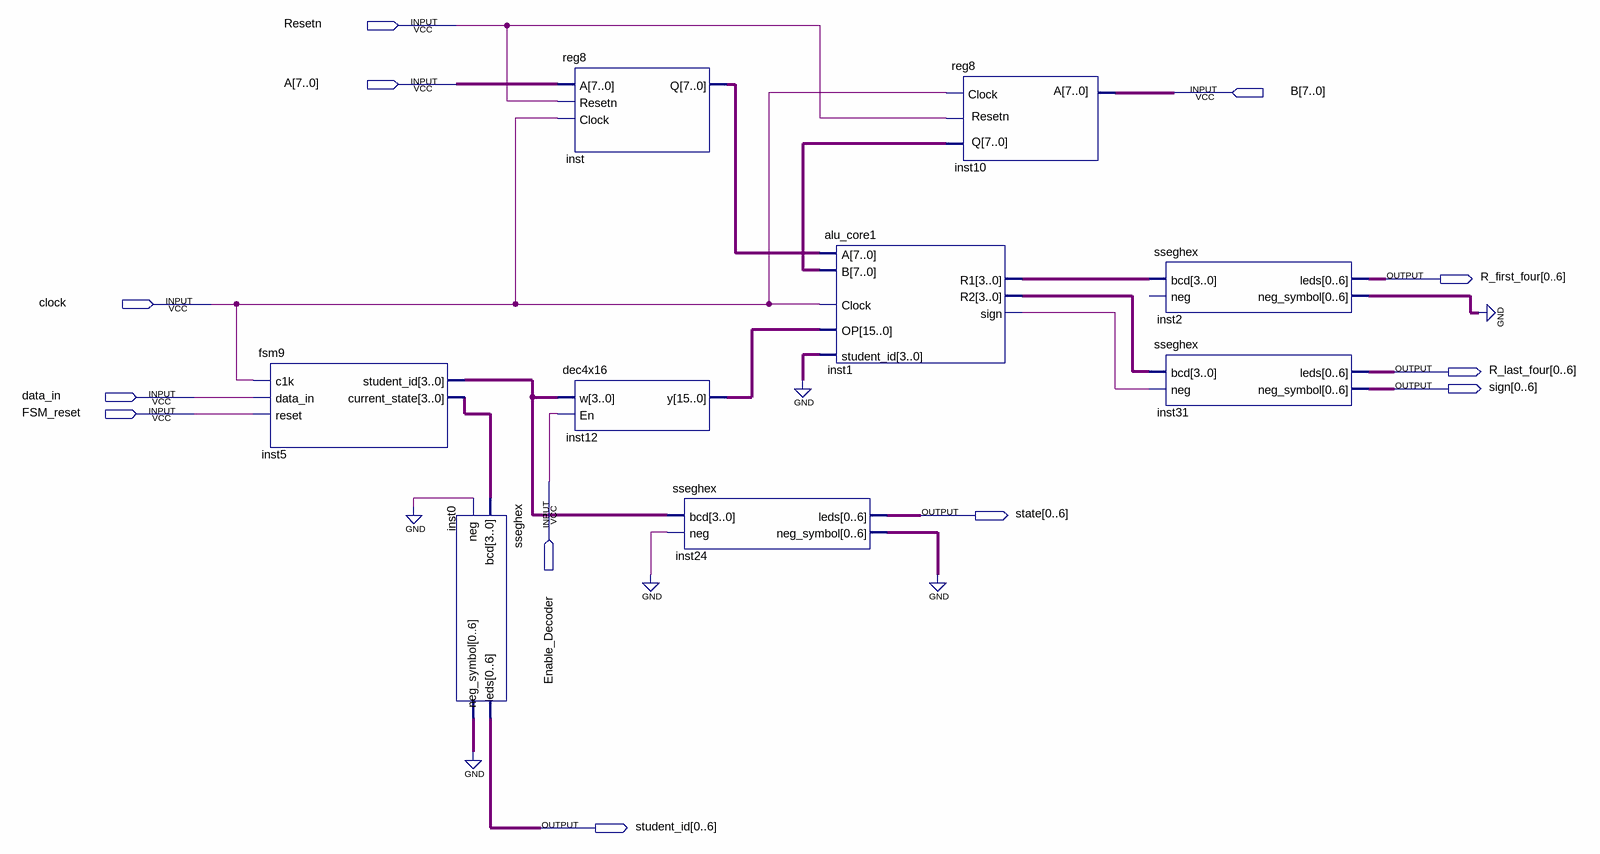
[diagram p0: schematic sheet]
// Quartus schematic Lab6_problem1.bdf as structural Verilog: 9 symbols, 12 pins
module Lab6_problem1 (
  input  Resetn,
  input  [7:0] A,
  input  [7:0] B,
  input  clock,
  input  data_in,
  input  FSM_reset,
  input  Enable_Decoder,
  output [0:6] R_first_four,
  output [0:6] R_last_four,
  output [0:6] sign,
  output [0:6] state,
  output [0:6] student_id
);

  wire inst1_sign;
  wire [3:0] inst1_r1, inst1_r2, inst5_current_state, inst5_student_id;
  wire [6:0] inst0_neg_symbol, inst2_neg_symbol, inst24_neg_symbol;
  wire [7:0] inst10_q, inst_q;
  wire [15:0] inst12_y;

  fsm9 inst5 (
    .c1k(clock), .data_in(data_in), .reset(FSM_reset), .student_id(inst5_student_id),
    .current_state(inst5_current_state));
  sseghex inst0 (.bcd(inst5_current_state), .neg(1'b0), .leds(student_id), .neg_symbol(inst0_neg_symbol));
  reg8 inst (.A(A), .Resetn(Resetn), .Clock(clock), .Q(inst_q));
  dec4x16 inst12 (.w(inst5_student_id), .En(Enable_Decoder), .y(inst12_y));
  sseghex inst24 (.bcd(inst5_student_id), .neg(1'b0), .leds(state), .neg_symbol(inst24_neg_symbol));
  alu_core1 inst1 (
    .Clock(clock), .A(inst_q), .B(inst10_q), .student_id(4'b0000), .OP(inst12_y), .sign(inst1_sign),
    .R1(inst1_r1), .R2(inst1_r2));
  reg8 inst10 (.Resetn(Resetn), .Clock(clock), .A(B), .Q(inst10_q));
  sseghex inst2 (.bcd(inst1_r1), .leds(R_first_four), .neg_symbol(inst2_neg_symbol));  // open: neg
  sseghex inst31 (.bcd(inst1_r2), .neg(inst1_sign), .leds(R_last_four), .neg_symbol(sign));
  // also tied to GND on the sheet: {inst0_neg_symbol[0], inst0_neg_symbol[1], inst0_neg_symbol[2], inst0_neg_symbol[3], inst0_neg_symbol[4], inst0_neg_symbol[5], inst0_neg_symbol[6], inst2_neg_symbol[0], inst2_neg_symbol[1], inst2_neg_symbol[2], inst2_neg_symbol[3], inst2_neg_symbol[4], inst2_neg_symbol[5], inst2_neg_symbol[6], inst24_neg_symbol[0], inst24_neg_symbol[1], inst24_neg_symbol[2], inst24_neg_symbol[3], inst24_neg_symbol[4], inst24_neg_symbol[5], inst24_neg_symbol[6]}
endmodule
